# Altium schematic sheet 22uF SMD Ceramic 1210.schdoc
size 127 x 101 mm
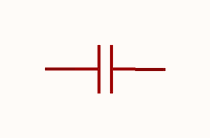
[diagram p0: 22uF SMD Ceramic 1210.schdoc]

## Parts
C?  22uF  [C1210]  (value not drawn)

## Nets

Not connected (* = marked no-connect by the designer): C? 1 2

## Library data of the parts
C? = C1210C226K8RACAUTO: Manufacturer: KEMET(基美); Add into BOM: yes; Tolerance: ±10%; Symbol: C1210C226K8RACAUTO; Device: C1210C226K8RACAUTO; LCSC Part Name: 22uF ±10% 10V; Supplier Part: C561843; Manufacturer Part: C1210C226K8RACAUTO; Supplier Footprint: 1210; JLCPCB Part Class: Extended Part; Datasheet: https://atta.szlcsc.com/upload/public/pdf/source/20200618/C561824_5D581F10239D32C68F7958F74E29471B.pdf; Supplier: LCSC; Convert to PCB: yes; Value: 22uF